# Altium schematic sheet SCH_HTTHTD.SchDoc: Hệ Thống Phun Sương Tự Động
size A; Address1: Bùi Anh Quốc; Address2: Huỳnh Quang Trí; Address3: Lê Phạm Xuân Quí; DocumentNumber: 1; Revision: 1; SheetNumber: 1; SheetTotal: 1; Parameter 1: 1; Parameter 2: 1; Rule: UNIONINDEX=0|RULEKIND=Clearance|NETSCOPE=DifferentNets|LAYERKIND=SameLayer|NAME=Schematic Clearance Constraint|GAP=10mil|GENERICCLEARANCE=10mil|IGNOREPADTOPADCLEARANCEINFOOTPRINT=FALSE|OBJECTCLEARANCES=ClearanceObj_Arc-ClearanceObj_Hole:0;ClearanceObj_Track-ClearanceObj_Hole:0;ClearanceObj_SMDPad-ClearanceObj_Hole:0;ClearanceObj_THPad-ClearanceObj_Hole:0;ClearanceObj_Via-ClearanceObj_Hole:0;ClearanceObj_Fill-ClearanceObj_Hole:0;ClearanceObj_Poly-ClearanceObj_Hole:0;ClearanceObj_Region-ClearanceObj_Hole:0;ClearanceObj_Text-ClearanceObj_Hole:0|UNIT=Imperial; Rule: UNIONINDEX=0|RULEKIND=Width|NETSCOPE=SameNetOnly|LAYERKIND=SameLayer|NAME=Schematic Width Constraint|MAXLIMIT=100mil|MINLIMIT=10mil|PREFEREDWIDTH=10mil|MIDLAYER1_MAXWIDTH=10mil|MIDLAYER2_MAXWIDTH=10mil|MIDLAYER3_MAXWIDTH=10mil|MIDLAYER4_MAXWIDTH=10mil|MIDLAYER5_MAXWIDTH=10mil|MIDLAYER6_MAXWIDTH=10mil|MIDLAYER7_MAXWIDTH=10mil|MIDLAYER8_MAXWIDTH=10mil|MIDLAYER9_MAXWIDTH=10mil|MIDLAYER10_MAXWIDTH=10mil|MIDLAYER11_MAXWIDTH=10mil|MIDLAYER12_MAXWIDTH=10mil|MIDLAYER13_MAXWIDTH=10mil|MIDLAYER14_MAXWIDTH=10mil|MIDLAYER15_MAXWIDTH=10mil|MIDLAYER16_MAXWIDTH=10mil|MIDLAYER17_MAXWIDTH=10mil|MIDLAYER18_MAXWIDTH=10mil|MIDLAYER19_MAXWIDTH=10mil|MIDLAYER20_MAXWIDTH=10mil|MIDLAYER21_MAXWIDTH=10mil|MIDLAYER22_MAXWIDTH=10mil|MIDLAYER23_MAXWIDTH=10mil|MIDLAYER24_MAXWIDTH=10mil|MIDLAYER25_MAXWIDTH=10mil|MIDLAYER26_MAXWIDTH=10mil|MIDLAYER27_MAXWIDTH=10mil|MIDLAYER28_MAXWIDTH=10mil|MIDLAYER29_MAXWIDTH=10mil|MIDLAYER30_MAXWIDTH=10mil|MINIMP=50.000000|MAXIMP=50.000000|FAVIMP=50.000000|UNIT=Imperial
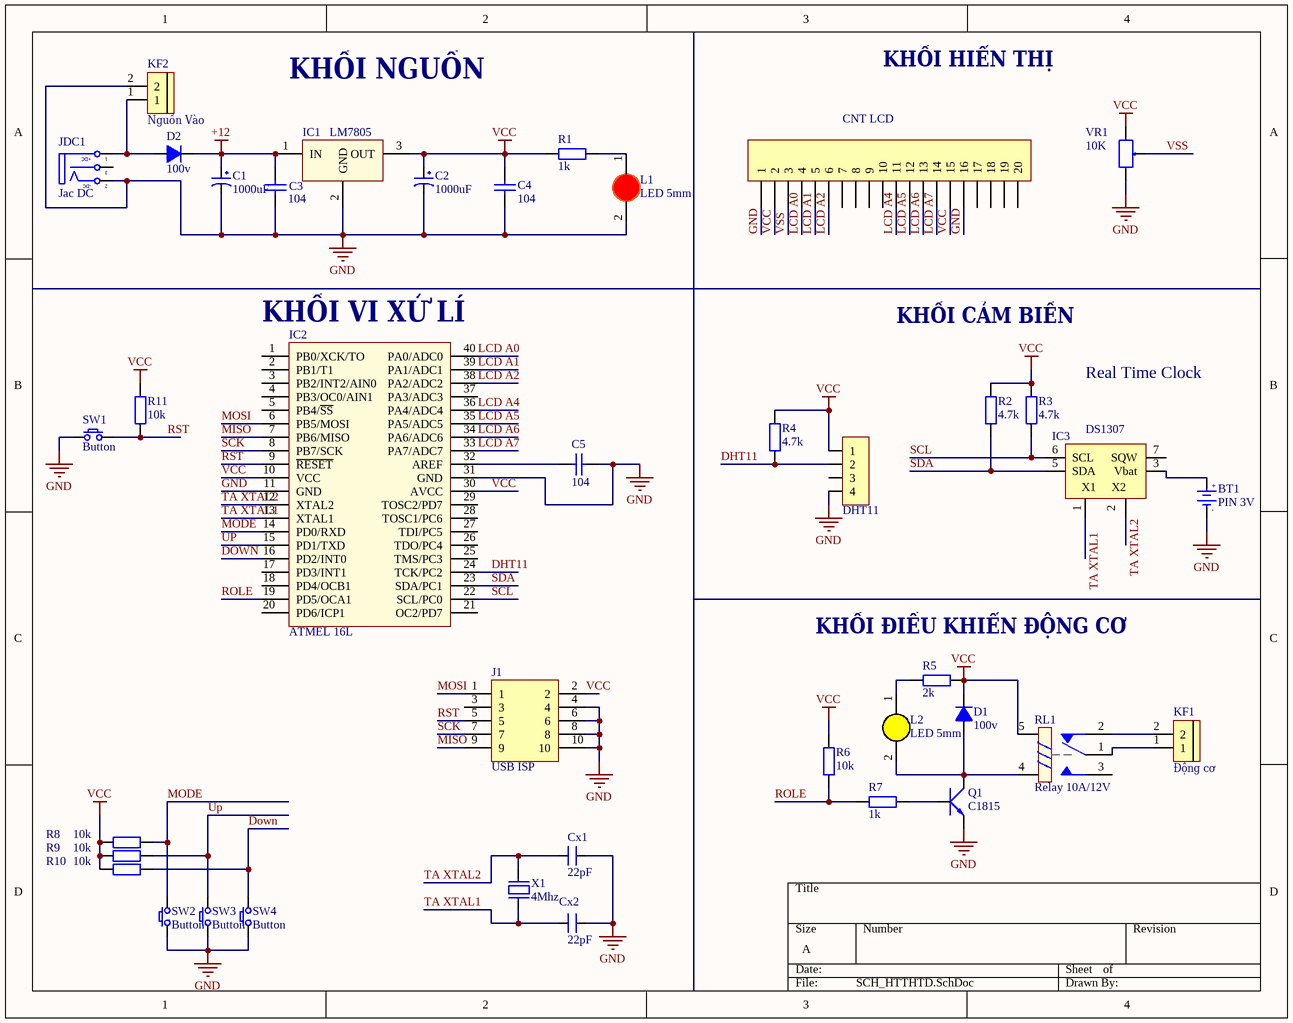
[diagram p0: SCH_HTTHTD.SchDoc]

## Parts
BT1  PIN 3V  [PIN3V]
C1  1000uF  [tu hoa 8mm]
C2  1000uF  [tu hoa 8mm]
C3  104  [tu gom]
C4  104  [tu gom]
C5  104  [tu gom]
Cx1  22pF  [CN1]
Cx2  22pF  [CN1]
D1  100v  [DIODE 0.5A]
D2  100v  [DIODE 1A]
IC1  LM7805  [QTO-220]
IC2  ATMEL 16L  [DIP40/W0.6]
IC3  DS1307  [DIP8/W0.3]
J1  USB ISP  [CON10_100_61201021621_TH_ST]
JDC1  Jac DC  [DC-IN]
JP1  CNT LCD  [JP 1x20 CT]
JP2  DHT11  [JP 1x4 CT]
KF1  Động cơ  [Con 2 KF301 5.08]
KF2  Nguồn Vào  [Con 2 KF301 5.08]
L1  LED 5mm  [LED-5MM-RED]
L2  LED 5mm  [LED-5MM-Yellow]
Q1  C1815  [QTO-92]
R1  1k  [tro vach 1/4w]
R2  4.7k  [tro vach 1/2w]
R3  4.7k  [tro vach 1/2w]
R4  4.7k  [tro vach 1/2w]
R5  2k  [tro vach 1/4w]
R6  10k  [tro vach 1/4w]
R7  1k  [tro vach 1/4w]
R8  10k  [tro vach 1/4w]
R9  10k  [tro vach 1/4w]
R10  10k  [tro vach 1/4w]
R11  10k  [tro vach 1/4w]
RL1  Relay 10A/12V  [RL_SPDT_10A]
SW1  Button  [SW/2/DIP]
SW2  Button  [SW/2/DIP]
SW3  Button  [SW/2/DIP]
SW4  Button  [SW/2/DIP]
VR1  10K  [VR]
X1  4Mhz  [XT2]

## Nets
+12: C1.1 C3.1 D2.2(K) IC1.1(IN)
GND: BT1.2(GND) C1.2 C2.2 C3.2 C4.2 C5.2 Cx1.2 Cx2.2 IC1.2(GND) IC2.11(GND) IC2.31(GND) IC3.4(GND) J1.4 J1.6 J1.8 J1.10 JDC1.2(TN) JP1.1 JP1.16 JP2.4 KF2.2 L1.2(K) Q1.1(E) SW1.1 SW2.1 SW3.1 SW4.1 VR1.3
VCC: C2.1 C4.1 D1.2(K) IC1.3(OUT) IC2.10(VCC) IC2.30(AVCC) IC3.8(VCC) J1.2 JP1.2 JP1.15 JP2.1 R1.1 R2.2 R3.2 R4.2 R5.2 R6.2 R8.1 R9.1 R10.1 R11.2 RL1.5 VR1.1
DHT11: IC2.24(TCK/PC2) JP2.2 R4.1
Down: IC2.16(PD2/INT0) R10.2 SW4.2
LCD A0: IC2.40(PA0/ADC0) JP1.4
LCD A1: IC2.39(PA1/ADC1) JP1.5
LCD A2: IC2.38(PA2/ADC2) JP1.6
LCD A4: IC2.36(PA4/ADC4) JP1.11
LCD A5: IC2.35(PA5/ADC5) JP1.12
LCD A6: IC2.34(PA6/ADC6) JP1.13
LCD A7: IC2.33(PA7/ADC7) JP1.14
MISO: IC2.7(PB6/MISO) J1.9
MODE: IC2.14(PD0/RXD) R8.2 SW2.2
MOSI: IC2.6(PB5/MOSI) J1.1
ROLE: IC2.19(PD5/OCA1) R6.1 R7.1
RST: IC2.9(~{RESET}) J1.5 R11.1 SW1.2
SCK: IC2.8(PB7/SCK) J1.7
SCL: IC2.22(SCL/PC0) IC3.6(SCL) R3.1
SDA: IC2.23(SDA/PC1) IC3.5(SDA) R2.1
TA XTAL1: Cx2.1 IC2.13(XTAL1) IC3.1(X1) X1.1
TA XTAL2: Cx1.1 IC2.12(XTAL2) IC3.2(X2) X1.2
Up: IC2.15(PD1/TXD) R9.2 SW3.2
VSS: JP1.3 VR1.2
NetBT1_1: BT1.1(+3V) IC3.3(Vbat)
NetC5_1: C5.1 IC2.32(AREF)
NetD1_1: D1.1(A) L2.2(K) Q1.2(C) RL1.4
NetD2_1: D2.1(A) JDC1.1(T) KF2.1
NetKF1_1: KF1.1 RL1.1
NetKF1_2: KF1.2 RL1.2
NetL1_1: L1.1(A) R1.2
NetL2_1: L2.1(A) R5.1
NetQ1_3: Q1.3(B) R7.2

Not connected (* = marked no-connect by the designer): IC2 1(PB0/XCK/TO) 2(PB1/T1) 3(PB2/INT2/AIN0) 4(PB3/OC0/AIN1) 5(PB4/~{SS}) 17(PD3/INT1) 18(PD4/OCB1) 20(PD6/ICP1) 21(OC2/PD7) 25(TMS/PC3) 26(TDO/PC4) 27(TDI/PC5) 28(TOSC1/PC6) 29(TOSC2/PD7) 37(PA3/ADC3); IC3 7(SQW); J1 3; JDC1 3(S); JP1 7 8 9 10 17 18 19 20; JP2 3; RL1 3

## Notes on the sheet
- KHỐI NGUỒN
- KHỐI HIỂN THỊ
- (near IC2) KHỐI VI XỬ LÍ
- KHỐI CẢM BIẾN
- Real Time Clock
- (near R5) KHỐI ĐIỀU KHIỂN ĐỘNG CƠ
- (in symbol DCIN) +DC; -DC
- (in symbol PIN 3V) +; -

## Library data of the parts
BT1 = PIN 3V: Battery 3VDC; Value: PIN 3V
C1 C2 = Tu Hoa 1000uF 16V 8x20: Cắm; Don_Vi: Con; So_Chan: 2; Ten_Linh_Kien: Tụ Hóa 1000uF 16V 8x20MM; Ma_Hang: MH008300; Chung_Loai: Cắm; Kieu_Chan: *
C3-C5 = Tu gom 104 50V: Cắm; So_Chan: 2; Ten_Linh_Kien: Tụ gốm 104 100nF 50V; Don_Vi: Con; Ma_Hang: MH004761; Chung_Loai: Cắm; Kieu_Chan: *
Cx1 Cx2 = CN0: Cremic For Xtal 1pF => 100pF; Value: 33pF
D1 = Diode 1N4148: Cắm; Ten_Linh_Kien: Diode 1N4148 DO35 450mA 100V ( 1N4148 DIP); Don_Vi: Con; Ma_Hang: MH001065; Ghi Chu: *; Kieu_Chan: *; Chung_Loai: Cắm
D2 = Diode 1N4007: Cắm; Ten_Linh_Kien: Diode 1N4007 1A (DIP); Don_Vi: Con; Ma_Hang: MH001063; Ghi Chu: *; Kieu_Chan: *; Chung_Loai: Cắm
IC1 = LM78xx: On ap +, from + 5 to + 24VDC; Value: LM7805
IC2 = Atmega16L: 8-Bit AVR Microcontroller with 16K Bytes of In-System Programmable Flash Memory; Value: Atmega 16L
IC3 = DS1307: Real Timer Serial; Value: DS1307
J1 = CON-PLG_5X2-100-ST-TH: 10 Pins, 2 Row 2.54mm Pitch, straight Connector, male; Manufacturer: Wurth Electronics; Manufacturer Part Number: 61201021621; Mating Part Number: 61201023021; Crimp Part Number: 63911015521CAB; Alternate Part Number-1: NA; Case/Package: TH-CON; Supplier-1: WURTH; Supplier Part Number-1: 61201021621
JDC1 = DCIN: Jac DC input; Value: Jac DC
JP1 = JP 1x20 2.54 Cai Thang: Cắm; Ten_Linh_Kien: Jump Đơn Cái 2.54MM 1x20P Thẳng; Don_Vi: Con; Ma_Hang: MH004006; Ghi_Chu: *; Kieu_Chan: *; Chung_Loai: Cắm
JP2 = JP 1x4 2.54 Cai Thang: Cắm; Ten_Linh_Kien: Jump Đơn Cái 2.54MM 1x20P Thẳng; Don_Vi: Con; Ma_Hang: MH004006; Ghi_Chu: *; Kieu_Chan: *; Chung_Loai: Cắm
KF1 KF2 = CON 2 KF301: Cắm; Ma_Hang: MH000987; Ten_Linh_Kien: CON 2 KF301-2P 5.08MM Xanh Dương; Don_Vi: Con; Chung_Loai: Cắm; Ghi_Chu: *; Kieu_Chan: *
L1 = LED 5mm Do: Cắm; Don_Vi: Con; Ma_Hang: MH008967; Ten_Linh_Kien: Led 5MM Phủ Đỏ (1000c); Ghi_Chu: *; Kieu_Chan: *; Chung_Loai: Cắm
L2 = LED 5mm Vang: Cắm; Don_Vi: Con; Ma_Hang: MH008968; Ten_Linh_Kien: Led 5MM Phủ Vàng (1000c); Ghi_Chu: *; Kieu_Chan: *; Chung_Loai: Cắm
Q1 = C1815: NPN 600mW, ECB; Value: C1815
R1 R7 = Tro Vach 1/4W 5% 1k: Cắm; Don_Vi: Con; So_Chan: 2; Ten_Linh_Kien: Trở Vạch 1/4w 5% 1k; Ma_Hang: MH007390; Chung_Loai: Cắm; Kieu_Chan: *
R2-R4 = Tro Vach 1/2W 5% 4.7k: Cắm; Don_Vi: Con; So_Chan: 2; Ten_Linh_Kien: Trở 5% 1/2w 4.7k; Ma_Hang: MH006198; Chung_Loai: Cắm; Kieu_Chan: *
R5 = Tro Vach 1/4W 5% 2k: Cắm; Don_Vi: Con; So_Chan: 2; Ten_Linh_Kien: Trở Vạch 1/4w 5% 2k; Ma_Hang: MH007305; Chung_Loai: Cắm; Kieu_Chan: *
R6 R8-R10 = Tro Vach 1/4W 1% 10k: Cắm; Don_Vi: Con; So_Chan: 2; Ten_Linh_Kien: Trở Vạch 1/4w 1% 10k; Ma_Hang: MH006349; Chung_Loai: Cắm; Kieu_Chan: *
R11 = Tro Vach 1/4W 5% 10k: Căm; Chung_Loai: Cắm; Don_Vi: Con; So_Chan: 2; Ten_Linh_Kien: Trở Vạch 1/4w 5% 10K; Ma_Hang: MH007354; Kieu_Chan: *
RL1 = Relay 1: Relay SPDT,10A - 12VDC 5 Pin; Value: Relay SPDT, 10A, 12V
SW1-SW4 = SW SPST: Tact switch 2 pin
VR1 = VR: Var Resistor; Value: VR 10K
X1 = XT2: Crystal For all Crystal 2pin.; Value: 4Mhz